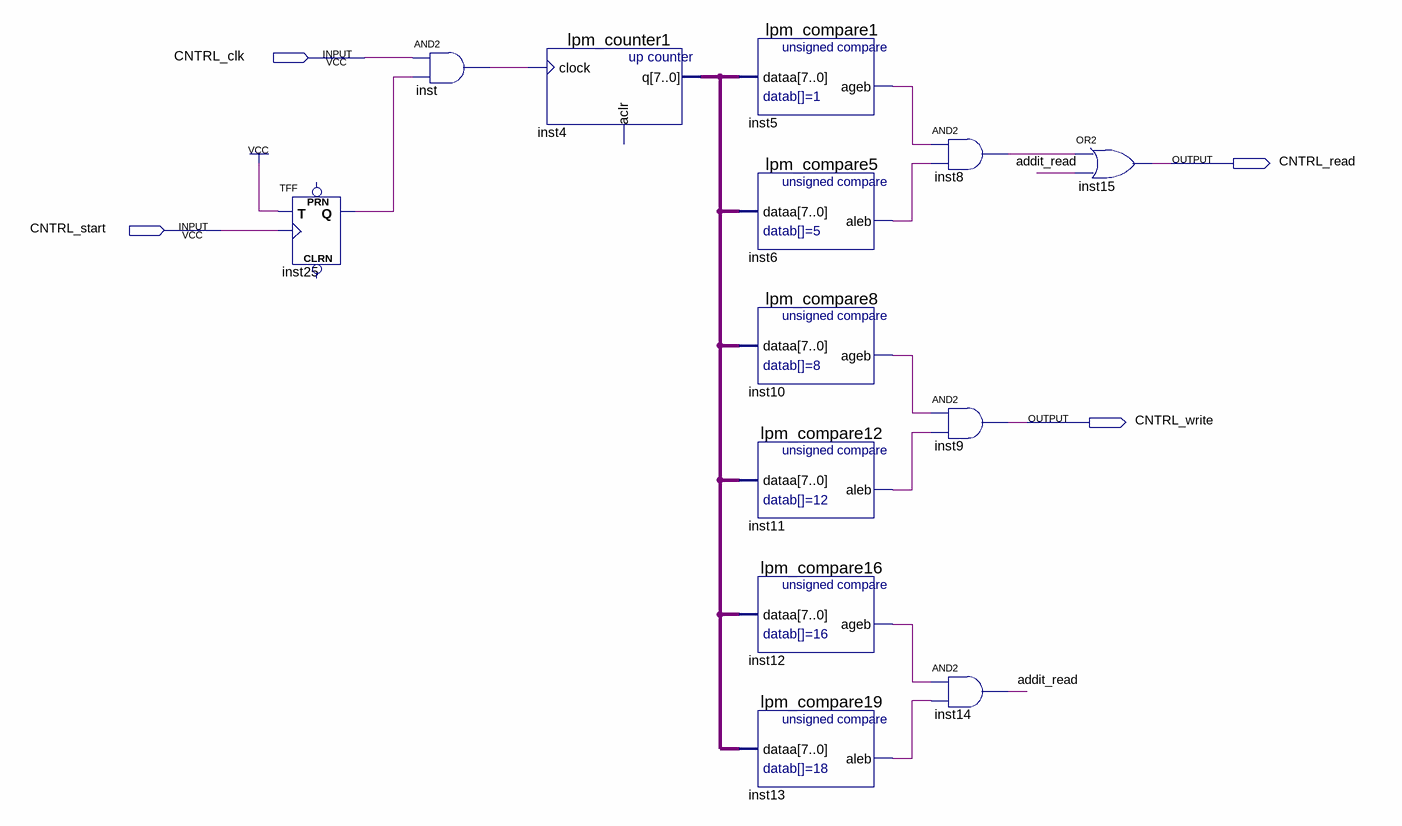
[diagram p0: schematic sheet]
// Quartus schematic CNTRL.bdf as structural Verilog: 13 symbols, 4 pins
module CNTRL (
  input  CNTRL_clk,
  input  CNTRL_start,
  output CNTRL_read,
  output CNTRL_write
);

  wire addit_read, inst5_ageb, inst6_aleb, inst8_out, inst10_ageb, inst11_aleb, inst12_ageb, inst13_aleb,
       inst25_q, inst_out;
  wire [7:0] inst4_q;

  TFF inst25 (.T(1'b1), .CLK(CNTRL_start), .Q(inst25_q));  // open: PRN, CLRN
  and inst (inst_out, CNTRL_clk, inst25_q);
  lpm_counter1 inst4 (.clock(inst_out), .q(inst4_q));  // open: aclr
  lpm_compare1 inst5 (.dataa(inst4_q), .ageb(inst5_ageb));
  lpm_compare5 inst6 (.dataa(inst4_q), .aleb(inst6_aleb));
  lpm_compare8 inst10 (.dataa(inst4_q), .ageb(inst10_ageb));
  lpm_compare12 inst11 (.dataa(inst4_q), .aleb(inst11_aleb));
  lpm_compare16 inst12 (.dataa(inst4_q), .ageb(inst12_ageb));
  lpm_compare19 inst13 (.dataa(inst4_q), .aleb(inst13_aleb));
  and inst8 (inst8_out, inst5_ageb, inst6_aleb);
  and inst9 (CNTRL_write, inst10_ageb, inst11_aleb);
  and inst14 (addit_read, inst12_ageb, inst13_aleb);
  or inst15 (CNTRL_read, inst8_out, addit_read);
endmodule
